# EAGLE design adapter-cast (EAGLE 6.5.0)
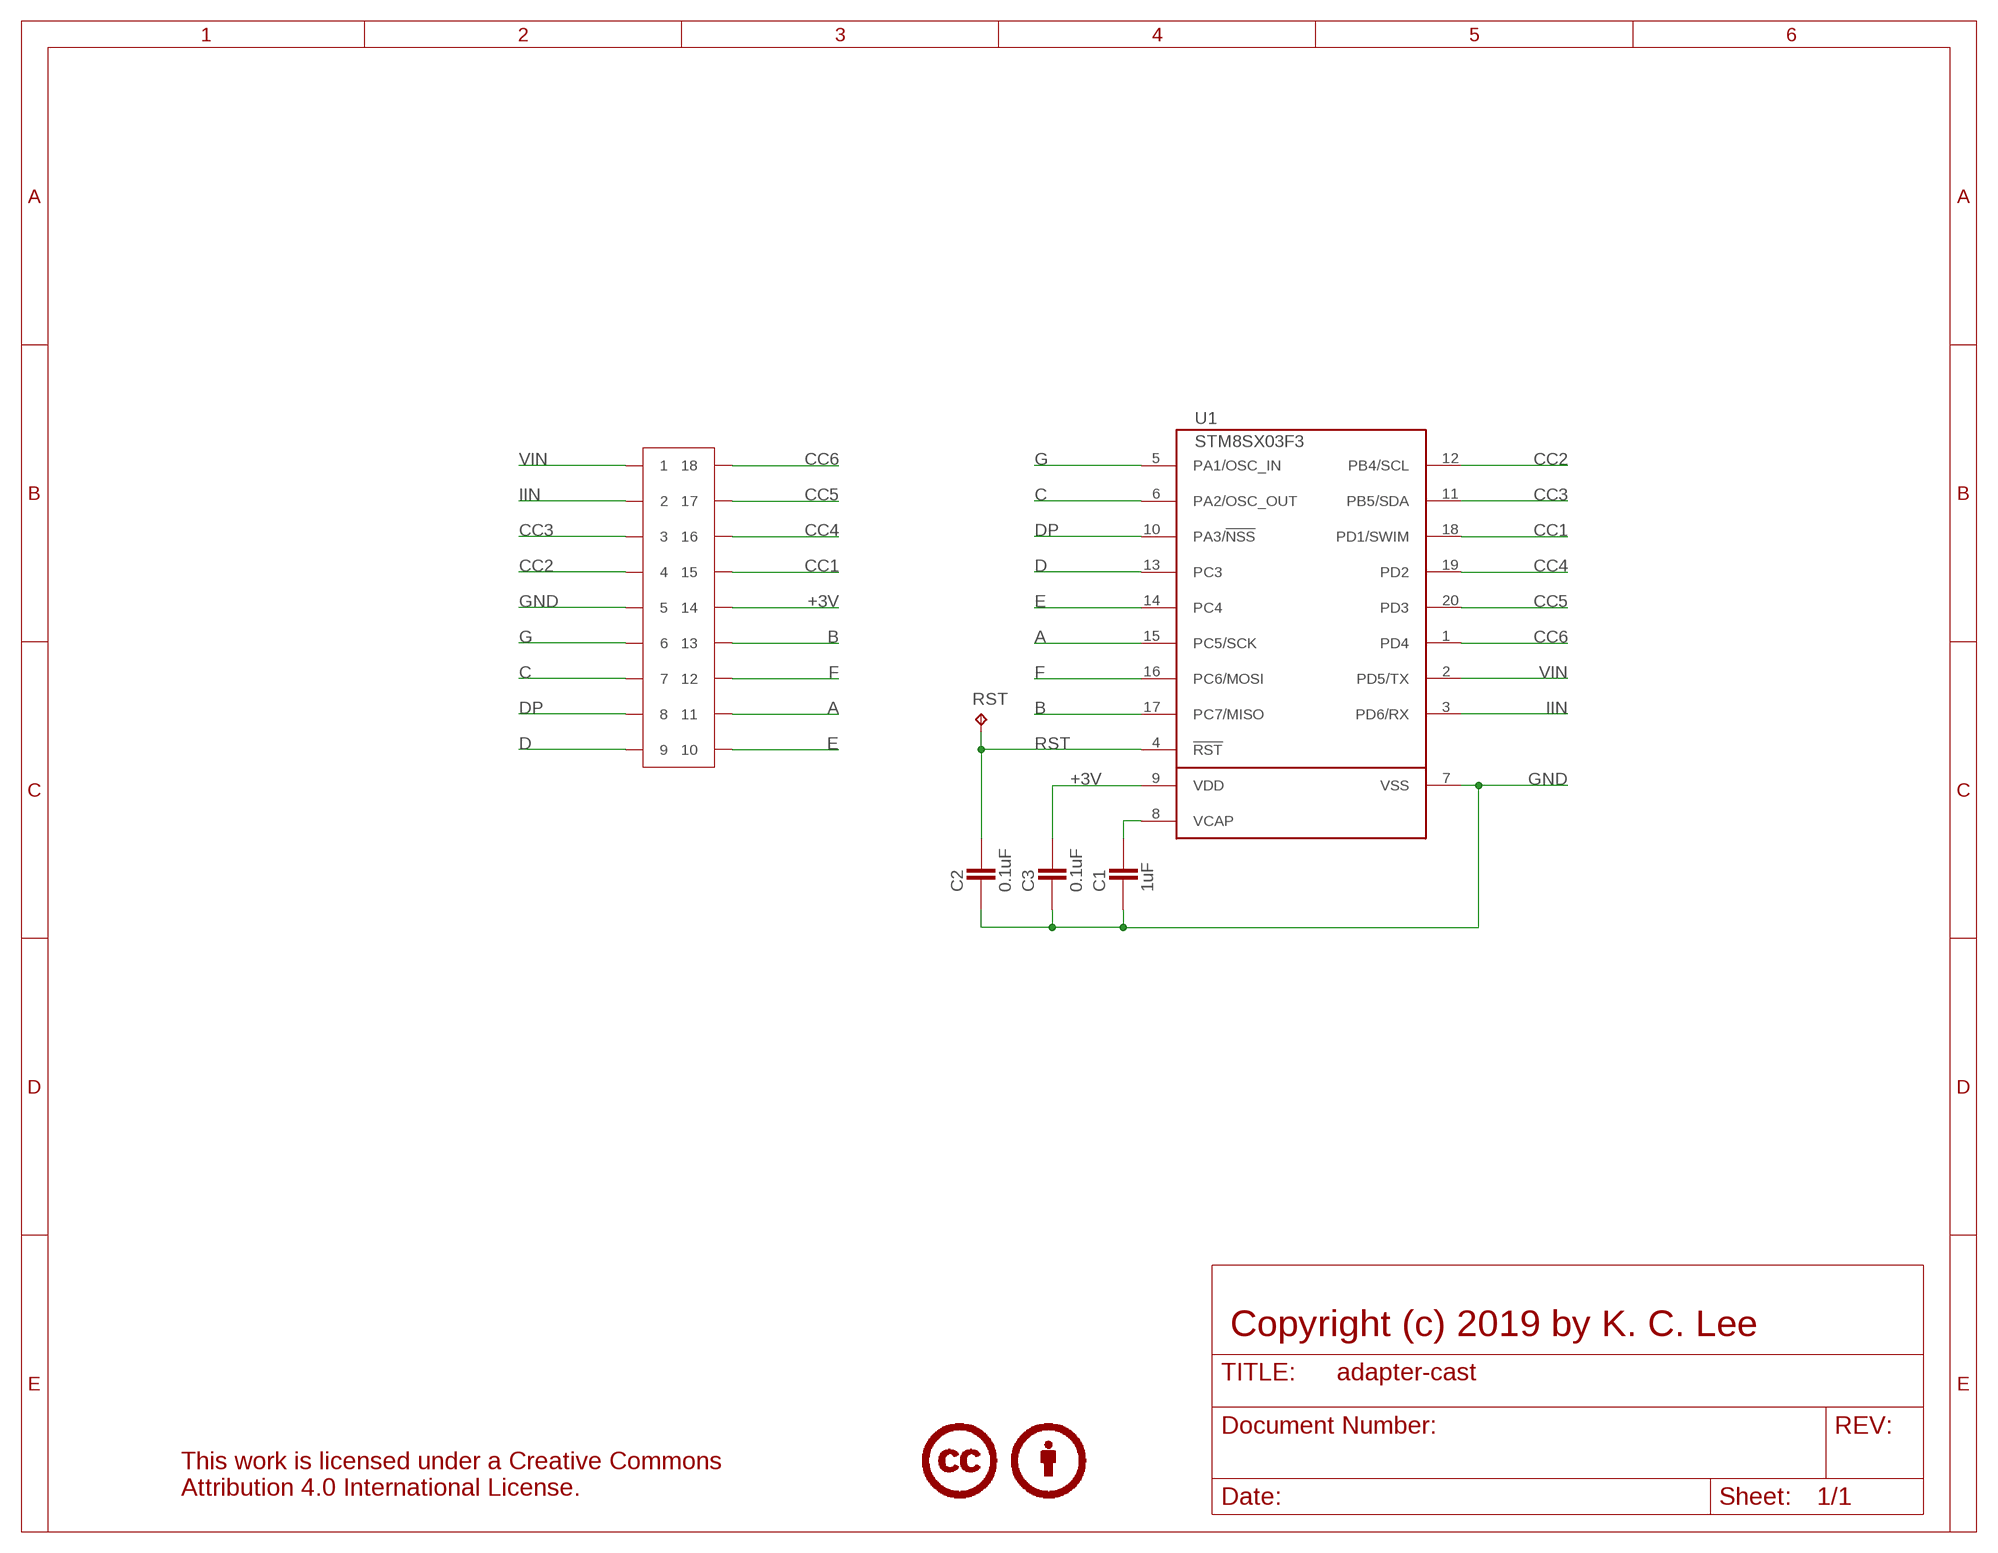
[diagram p0: schematic, sheet 1]

## Parts
C1  1uF  CAPACITOR_0603  [CAPC1608X92N]
C2  0.1uF  CAPACITOR_0603  [CAPC1608X92N]
C3  0.1uF  CAPACITOR_0603  [CAPC1608X92N]
LICENSE1  CC-BYNONE  [CC-NONE]
P1  DUMMY-SO18WCAST  [SO18W-CAST]
RST  TP  TPTP11SQ  [TP11SQ]
U1  STM8SX03F3  [TSSOP20]

## Nets
+3V: C3.2 P1.P$14 U1.9(VDD)
A: P1.P$11 U1.15(PC5/SCK)
B: P1.P$13 U1.17(PC7/MISO)
C: P1.P$7 U1.6(PA2/OSC_OUT)
CC1: P1.P$15 U1.18(PD1/SWIM)
CC2: P1.P$4 U1.12(PB4/SCL)
CC3: P1.P$3 U1.11(PB5/SDA)
CC4: P1.P$16 U1.19(PD2)
CC5: P1.P$17 U1.20(PD3)
CC6: P1.P$18 U1.1(PD4)
D: P1.P$9 U1.13(PC3)
DP: P1.P$8 U1.10(PA3/!NSS)
E: P1.P$10 U1.14(PC4)
F: P1.P$12 U1.16(PC6/MOSI)
G: P1.P$6 U1.5(PA1/OSC_IN)
GND: C1.1 C2.1 C3.1 P1.P$5 U1.7(VSS)
IIN: P1.P$2 U1.3(PD6/RX)
N$1: C1.2 U1.8(VCAP)
RST: C2.2 RST.TP U1.4(!RST)
VIN: P1.P$1 U1.2(PD5/TX)

## Notes on the sheet
- Copyright (c) 2019 by K. C. Lee

## Library data of the parts
C1-C3 = ipc-7351-capacitor:CAPACITOR_
LICENSE1 = Misc logo:CC-BY
P1 = misc pcb:DUMMY-SO18W
RST = testpad:TP: Test pad
U1 = Misc Processor:STM8SX03F

## Board
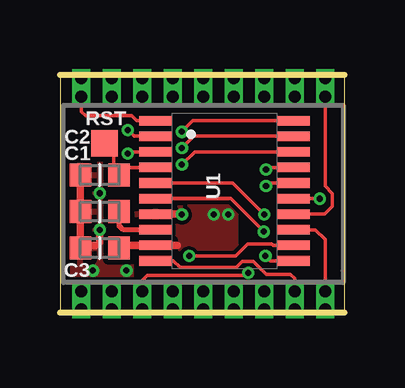
[diagram p1: board, top side]
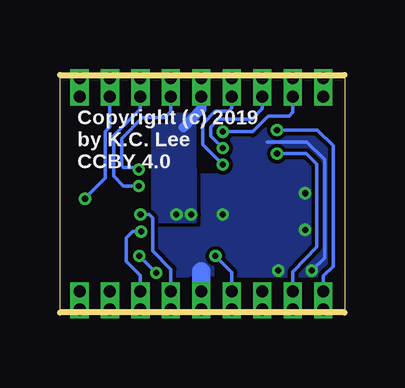
[diagram p2: board, bottom side, seen from below]

Size 11.86 x 9.91 mm. Coordinates in mm from the lower left corner, seen from the top.
Outline: 0,0 11.86,0 11.86,9.91 0,9.91 0,0
Copper layers (1*16): Top 0.035559375mm / dielectric 1.6mm / Bottom 0.035559375mm
Design rules "oshpark-2layer-tented-vias": minimum track width 6mil, minimum drill 10mil, track to track 6mil, track to pad 6mil, pad to pad 6mil, via to via 6mil, smd to smd 6mil, copper to edge 15mil, drill to drill 6mil, minimum pad ring 5mil, minimum via ring 5mil, stop-mask expansion 2.5mil, vias tented up to drill 13mil, thermal gap 10mil
tRestrict: 4 lines
bRestrict: 3 lines

### Footprints (pad centres in the part's own frame; a part is rotated, then mirrored left to right if it is on the bottom)
CAPC1608X92N = smd 0.9 x 0.95: 1 -0.8,0; 2 0.8,0
SO18W-CAST = drill 0.5 square: P$1 -5.08,-4.064; P$2 -3.81,-4.064; P$3 -2.54,-4.064; P$4 -1.27,-4.064; P$5 0,-4.064; P$6 1.27,-4.064; P$7 2.54,-4.064; P$8 3.81,-4.064; P$9 5.08,-4.064; P$10 5.08,4.064; P$11 3.81,4.064; P$12 2.54,4.064; P$13 1.27,4.064; P$14 0,4.064; P$15 -1.27,4.064; P$16 -2.54,4.064; P$17 -3.81,4.064; P$18 -5.08,4.064
TP11SQ = smd 1.1 x 1.1: TP 0,0
TSSOP20 = smd 0.4 x 1.35: 1 -2.925,-2.875; 2 -2.275,-2.875; 3 -1.625,-2.875; 4 -0.975,-2.875; 5 -0.325,-2.875; 6 0.325,-2.875; 7 0.975,-2.875; 8 1.625,-2.875; 9 2.275,-2.875; 10 2.925,-2.875; 11 2.925,2.875; 12 2.275,2.875; 13 1.625,2.875; 14 0.975,2.875; 15 0.325,2.875; 16 -0.325,2.875; 17 -0.975,2.875; 18 -1.625,2.875; 19 -2.275,2.875; 20 -2.925,2.875

### Placement (x,y rotation side)
C1  1.65,4.22 0 top
C2  1.65,5.74 0 top
C3  1.65,2.69 0 top
LICENSE1  -0.25,-1.02 0 top
P1  5.97,4.95 0 top
RST  1.85,7.06 0 top
U1  6.86,5.08 270 top

### Tracks (layer width: path | path; a pad name or v marks a point on that pad's centre or on a via)
+3V  (via drill 0.25, 0.5)
  Top 0.305: C3.2 2.57,2.8 U1.9 4.89,2.8
  Bottom 0.406: P1.P$14 5.97,8.48 6.71,7.72
  Bottom 0.762: P1.P$14 v5.97,9.78
  other vias: 6.4,4.09 7.01,4.09
  pour Bottom: 6.25,8.28 6.22,3.81 8,3.81 8,8.25
  pour Top: 4.7,4.83 4.7,2.16 7.37,2.16 7.37,4.83
A  (via drill 0.25, 0.5)
  Top 0.152: U1.15 v10.83,4.75 v10.82,4.75
  Bottom 0.152: P1.P$11 9.78,7.75 9.98,7.54 9.98,5.61 v10.82,4.75
  Bottom 0.762: P1.P$11 v9.78,9.78
B  (via drill 0.25, 0.5)
  Top 0.152: U1.17 8.68,6.05 v8.58,5.97
  Bottom 0.152: P1.P$13 7.24,8.38 7.49,8.13 8.43,8.13 9.3,7.26 9.3,6.13 9.22,6.05 8.67,6.05 v8.58,5.97
  Bottom 0.762: P1.P$13 v7.24,9.78
C  (via drill 0.25, 0.5)
  Top 0.152: U1.6 7.11,4.75 v8.48,3.38
  Bottom 0.152: P1.P$7 8.51,1.55 9.09,2.13 9.09,3.12 8.84,3.38 v8.48,3.38
  Bottom 0.762: P1.P$7 v8.51,0.13
CC1  (via drill 0.25, 0.5)
  Top 0.152: U1.18 5.61,6.71 v5.08,6.17
  Bottom 0.152: P1.P$15 4.7,8.53 4.83,8.41 5.38,8.41 5.92,7.87 5.92,7.01 v5.08,6.17
  Bottom 0.762: P1.P$15 v4.7,9.78
CC2  (via drill 0.25, 0.5)
  Top 0.152: v5.38,2.36 7.31,2.36 7.82,2.87 8.81,2.87 8.88,2.8 U1.12
  Bottom 0.152: P1.P$4 4.7,1.68 v5.38,2.36
  Bottom 0.762: P1.P$4 v4.7,0.13
CC3  (via drill 0.25, 0.5)
  Top 0.152: 9.71,2.13 U1.11 8.77,2.16 v8.56,2.36 | P1.P$3 3.43,1.35 3.63,1.55 7.75,1.55 v7.85,1.65
  Bottom 0.152: v7.85,1.65 v8.56,2.36
  Bottom 0.762: P1.P$3 v3.43,0.13
CC4  (via drill 0.25, 0.5)
  Top 0.152: U1.19 5.58,7.36 v5.08,6.86
  Bottom 0.152: v5.08,6.86 5.59,7.37 5.59,7.75 5.26,8.08 3.86,8.08 3.43,8.51 P1.P$16
  Bottom 0.762: P1.P$16 v3.43,9.78
CC5  (via drill 0.25, 0.5)
  Top 0.152: U1.20 5.54,8 v5.08,7.54
  Bottom 0.152: P1.P$17 2.16,8.36 2.31,8.2 3.17,8.2 3.84,7.54 v5.08,7.54
  Bottom 0.762: P1.P$17 v2.16,9.78
CC6  (via drill 0.5)
  Top 0.152: U1.1 3.2,8 2.99,8.21 1.06,8.21 0.89,8.38 P1.P$18
  Bottom 0.762: P1.P$18 v0.89,9.78
D  (via drill 0.5)
  Top 0.152: U1.13 10.64,3.46 11.05,3.05 P1.P$9
  Bottom 0.762: P1.P$9 v11.05,0.13
DP  (via drill 0.5)
  Top 0.152: U1.10 4.73,2.16 5,1.88 7.34,1.88 7.59,2.13 8.05,2.13 8.58,1.6 9.6,1.6 9.78,1.42 P1.P$8
  Bottom 0.762: P1.P$8 v9.78,0.13
E  (via drill 0.5)
  Top 0.152: P1.P$10 11.05,5.28 11.35,4.98 11.35,4.42 11.04,4.1 U1.14
  Bottom 0.762: P1.P$10 v11.05,9.78
F  (via drill 0.25, 0.5)
  Top 0.152: U1.16 8.71,5.4 v8.58,5.28
  Bottom 0.152: v8.58,5.28 9.22,5.28 9.63,5.69 9.63,7.39 8.51,8.48 P1.P$12
  Bottom 0.762: P1.P$12 v8.51,9.78
G  (via drill 0.25, 0.5)
  Top 0.152: U1.5 7.19,5.4 v8.51,4.09
  Bottom 0.152: P1.P$6 7.24,1.8 8,2.57 8,3.94 8.15,4.09 v8.51,4.09
  Bottom 0.762: P1.P$6 v7.24,0.13
GND  (via drill 0.25, 0.5)
  Top 0.305: C3.1 C1.1 C2.1 | U1.7 5.01,4.1 v5.08,4.09 | v1.65,3.45 1.65,2.95 | 1.5,2.79 0.84,2.79
  Bottom 0.152: v1.37,1.75 0.84,2.29 0.84,6.38 1.58,7.11 3.23,7.11
  Bottom 0.762: v5.97,0.13 P1.P$5 5.97,1.73
  other vias: 1.65,4.98 2.77,1.75
  pour Bottom (rank 5): 0,7.75 11.81,7.75 11.81,1.52 0,1.52
  pour Top (isolate 0.203, rank 5): 11.81,8.51 0,8.51 0,1.55 11.81,1.55
IIN  (via drill 0.25, 0.5)
  Top 0.152: U1.3 2.9,6.71 v2.82,6.63
  Bottom 0.152: v2.82,6.63 1.6,6.63 1.17,6.2 1.17,2.74 2.16,1.7 P1.P$2
  Bottom 0.762: P1.P$2 v2.16,0.13
N$1
  Top 0.203: U1.8 2.64,3.46 2.45,3.64 C1.2
RST
  Top 0.152: U1.4 2.74,6.05 C2.2 2.23,5.96 2.23,6.91 2.08,7.06 RST.TP
VIN  (via drill 0.25, 0.5)
  Top 0.152: U1.2 3.08,7.36 v2.82,7.62
  Bottom 0.152: v2.82,7.62 1.14,7.62 0.48,6.96 0.48,1.93 0.89,1.52 P1.P$1
  Bottom 0.762: P1.P$1 v0.89,0.13

### Text on the board
bNames: Copyright (c) 2019 / by K.C. Lee / CCBY 4.0